# Altium schematic sheet RFR24 AMS Design - Fault V1.SchDoc
size A; SheetNumber: 10; SheetTotal: 10
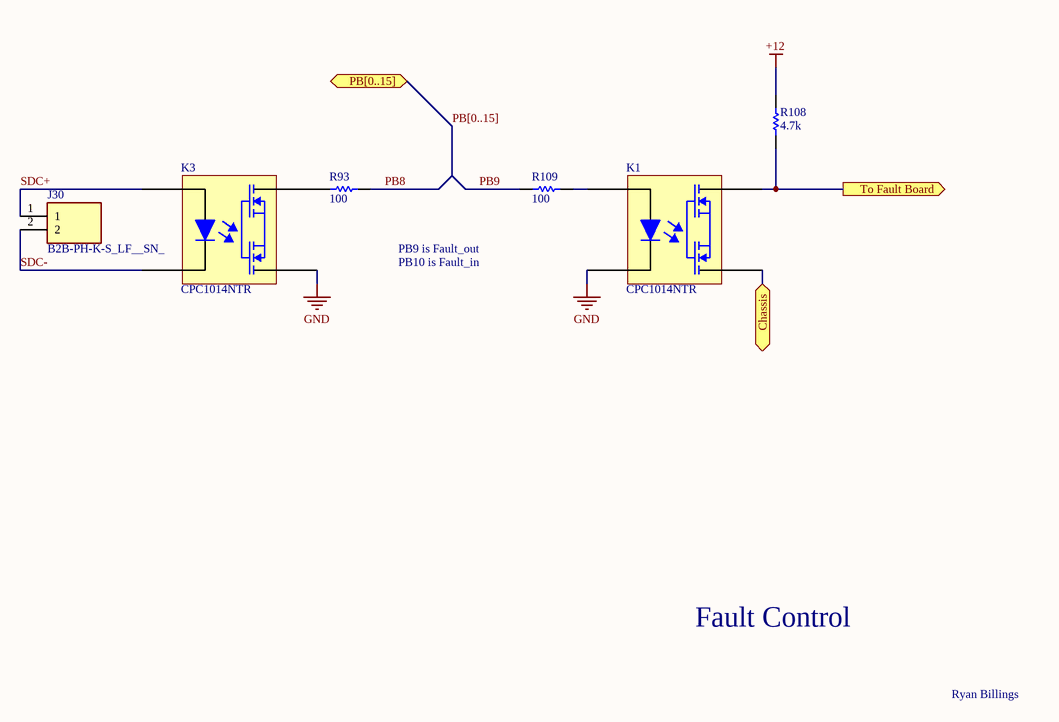
[diagram p0: RFR24 AMS Design - Fault V1.SchDoc]

## Parts
J30  B2B-PH-K-S_LF__SN_  [SHDR2W50P0X200_1X2_590X450X600P]
K1  CPC1014NTR  [CPC1014]
K3  CPC1014NTR  [CPC1014]
R93  value 100  [RESC2013X70X40LL20T20]  (hidden comment: Resistor 1k +/-1% 0805 125 mW)
R108  value 4.7k  [RESC2013X70X40LL20T20]  (hidden comment: Resistor 1k +/-1% 0805 125 mW)
R109  value 100  [RESC2013X70X40LL20T20]  (hidden comment: Resistor 1k +/-1% 0805 125 mW)

## Ports
Chassis (bidir), PB[0..15] (bidir), To Fault Board (out)

## Nets
+12: R108.2
GND: K1.2 K3.3
Chassis: K1.3 ; port Chassis
PB8: R93.1
PB9: R109.2
SDC+: J30.1 K3.1
SDC-: J30.2 K3.2
To Fault Board: K1.4 R108.1 ; port To Fault Board
NetK1_1: K1.1 R109.1
NetK3_4: K3.4 R93.2

## Buses and harness runs
bus PB[0..15] = port PB[0..15]

## Notes on the sheet
- PB9 is Fault_out
- PB10 is Fault_in
- Fault Control
- Ryan Billings

## Library data of the parts
J30 = B2B-PH-K-S_LF__SN_: Connector; Manufacturer_Name: JST (JAPAN SOLDERLESS TERMINALS); Manufacturer_Part_Number: B2B-PH-K-S(LF)(SN); Datasheet Link: https://datasheet.lcsc.com/szlcsc/JST-Sales-America-B2B-PH-K-S-LF-SN_C131337.pdf; Height: 6mm; Arrow Part Number: B2B-PH-K-S(LF)(SN); Arrow Price/Stock: https://www.arrow.com/en/products/b2b-ph-k-s-lf-sn/jst-manufacturing?region=europe
K1 K3 = CMP-329-000002-2: SSR RELAY SPST-NO (1 Form A) 4-SOP (0.150", 3.81mm); Component Type: Standard; ComponentLink1URL: https://www.digikey.com/en/products/detail/ixys-integrated-circuits-division/CPC1014NTR/1973284; Source: CPC1014NTR.SchLib; ComponentLink2Description: Datasheet; Pin Count: 4; ComponentLink2URL: https://www.ixysic.com/home/pdfs.nsf/www/CPC1014N.pdf/$file/CPC1014N.pdf; ComponentLink1Description: DigiKey Link; Design Item ID: IXYS CPC1014NTR
R93 R108 R109 = CMP-009-00010-5: Chip Resistor, 1 KOhm, +/- 1%, 0.125 W, -55 to 155 degC, 0805 (2013 Metric); Power: 125mW; Voltage Rating: 150V; Tolerance: 1%; RoHS Compliant: True; Mounting Technology: SM; Pins: 2; Case/Package: 0805; Max Operating Temperature: 155°C; Min Operating Temperature: -55°C